# EAGLE schematic sx1509-breakout_mount_remap5 (EAGLE 9.1.3)
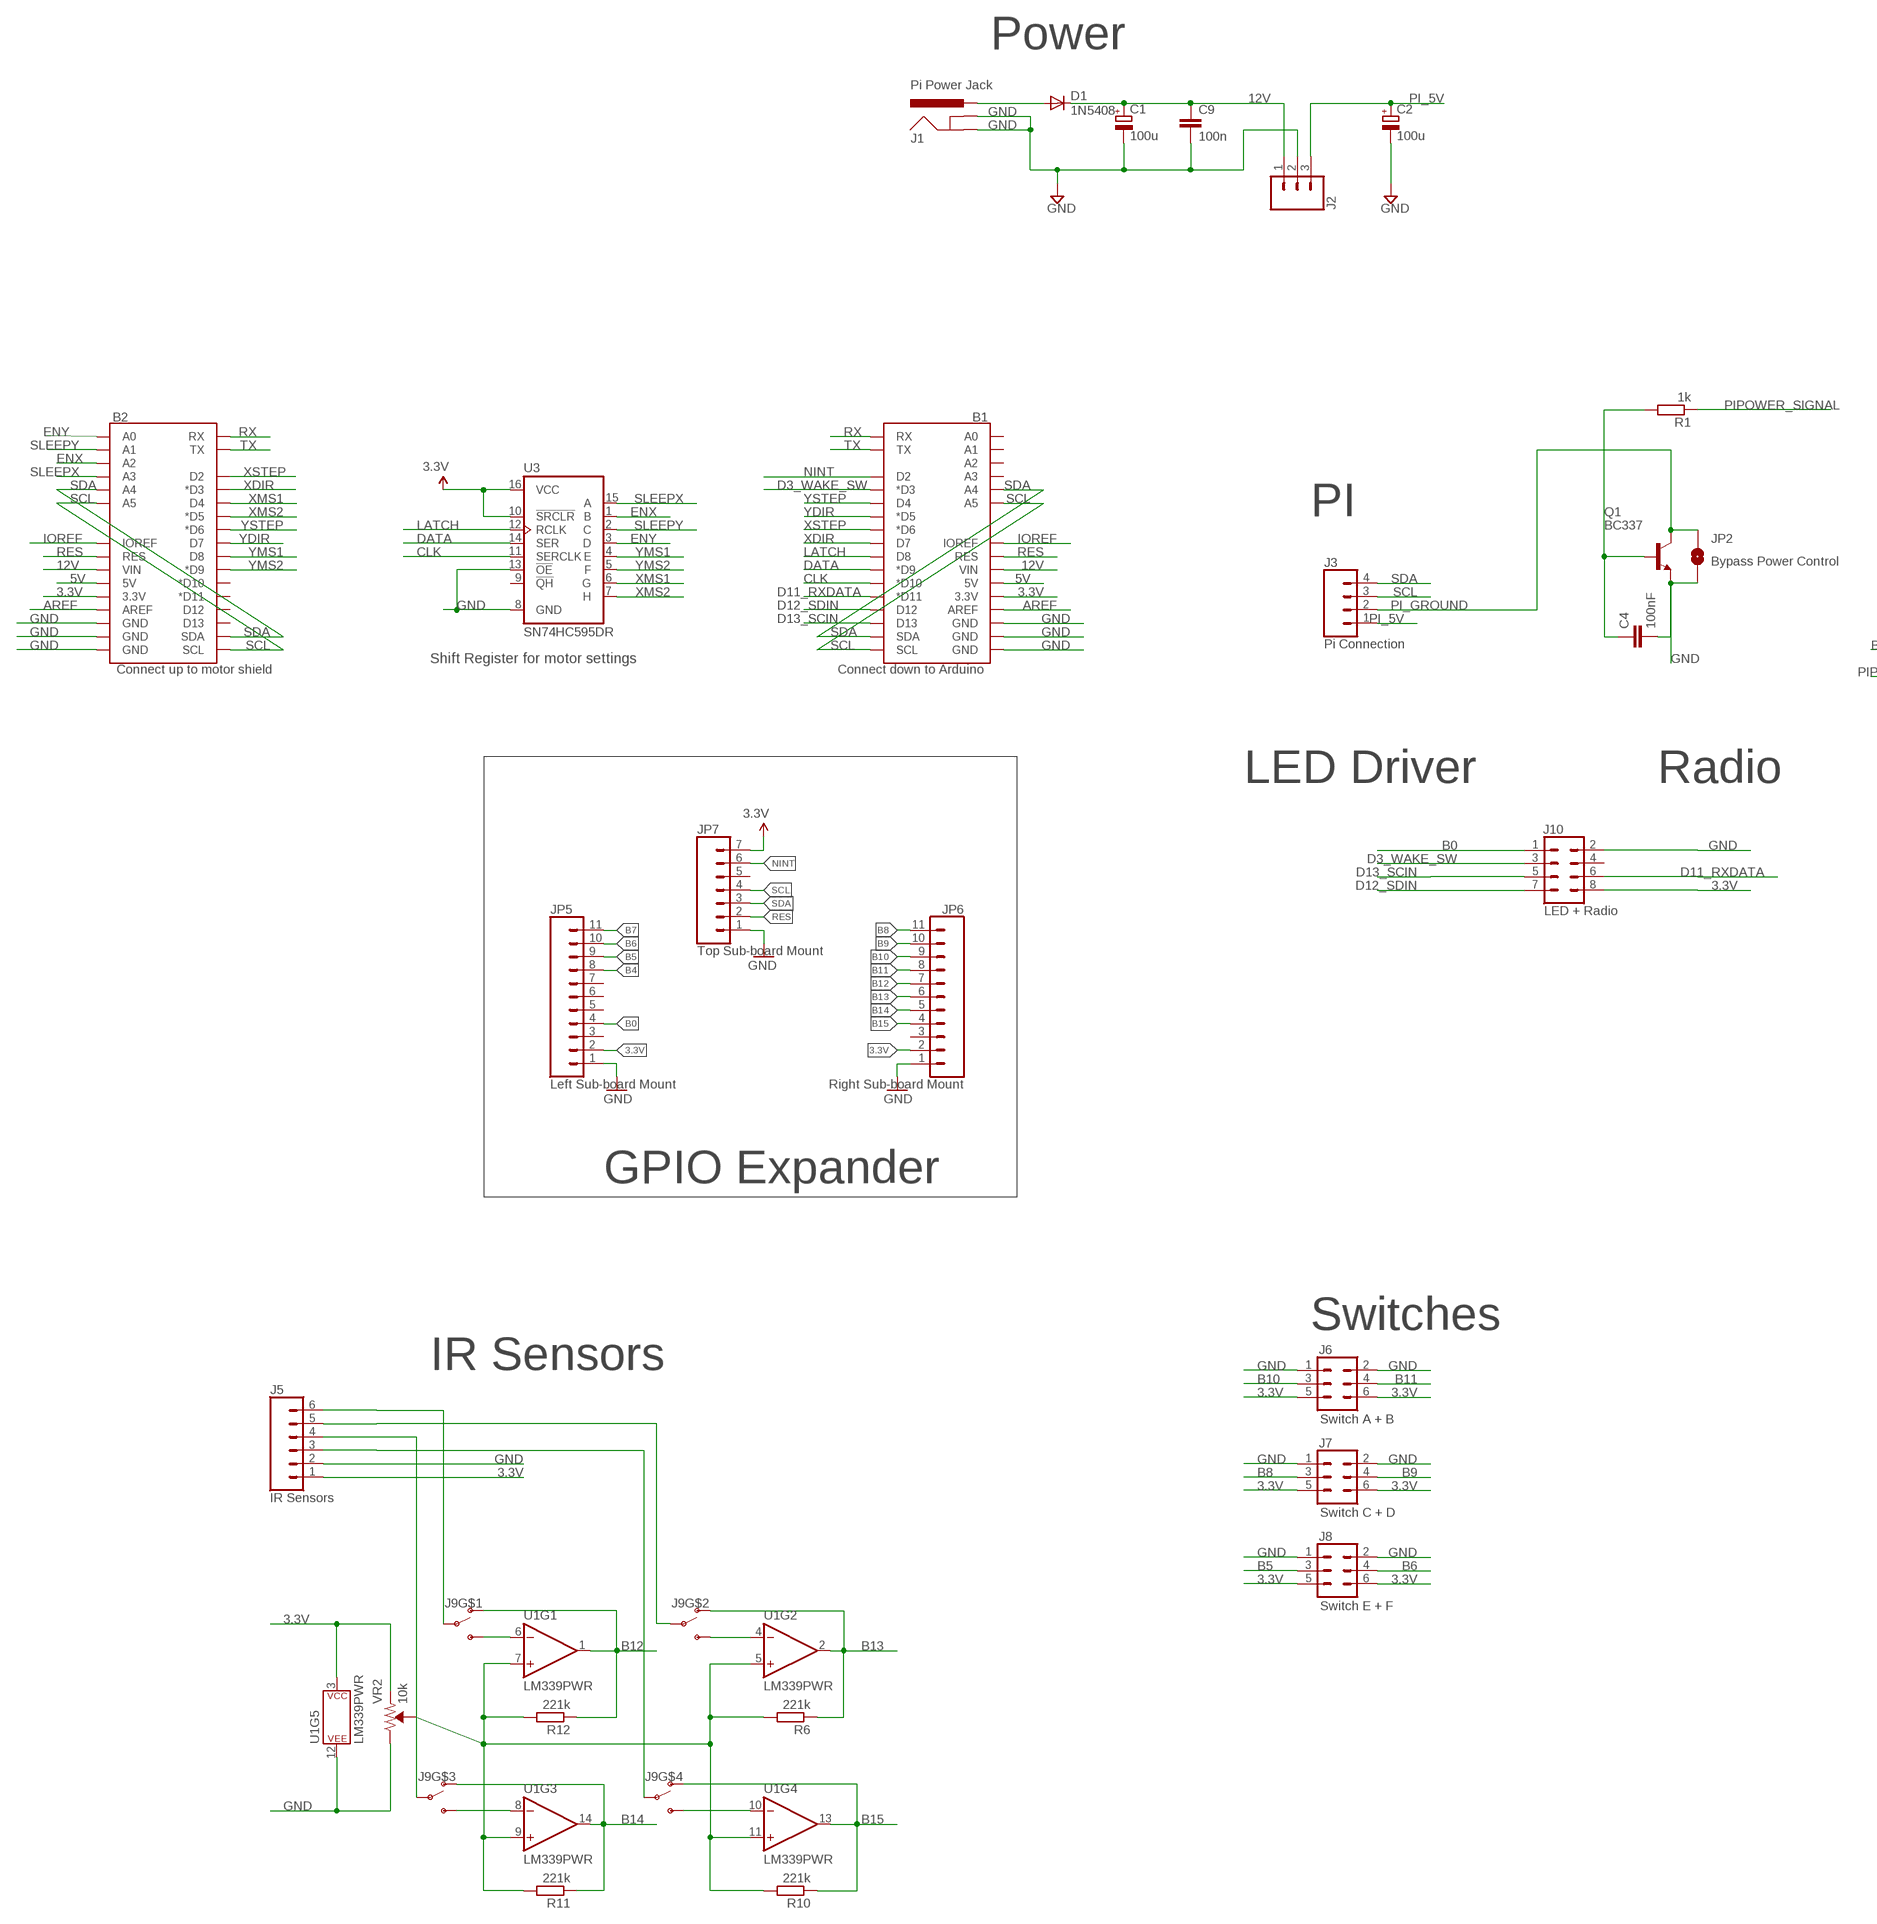
[diagram p0: schematic, sheet 1, part 1 of 2]
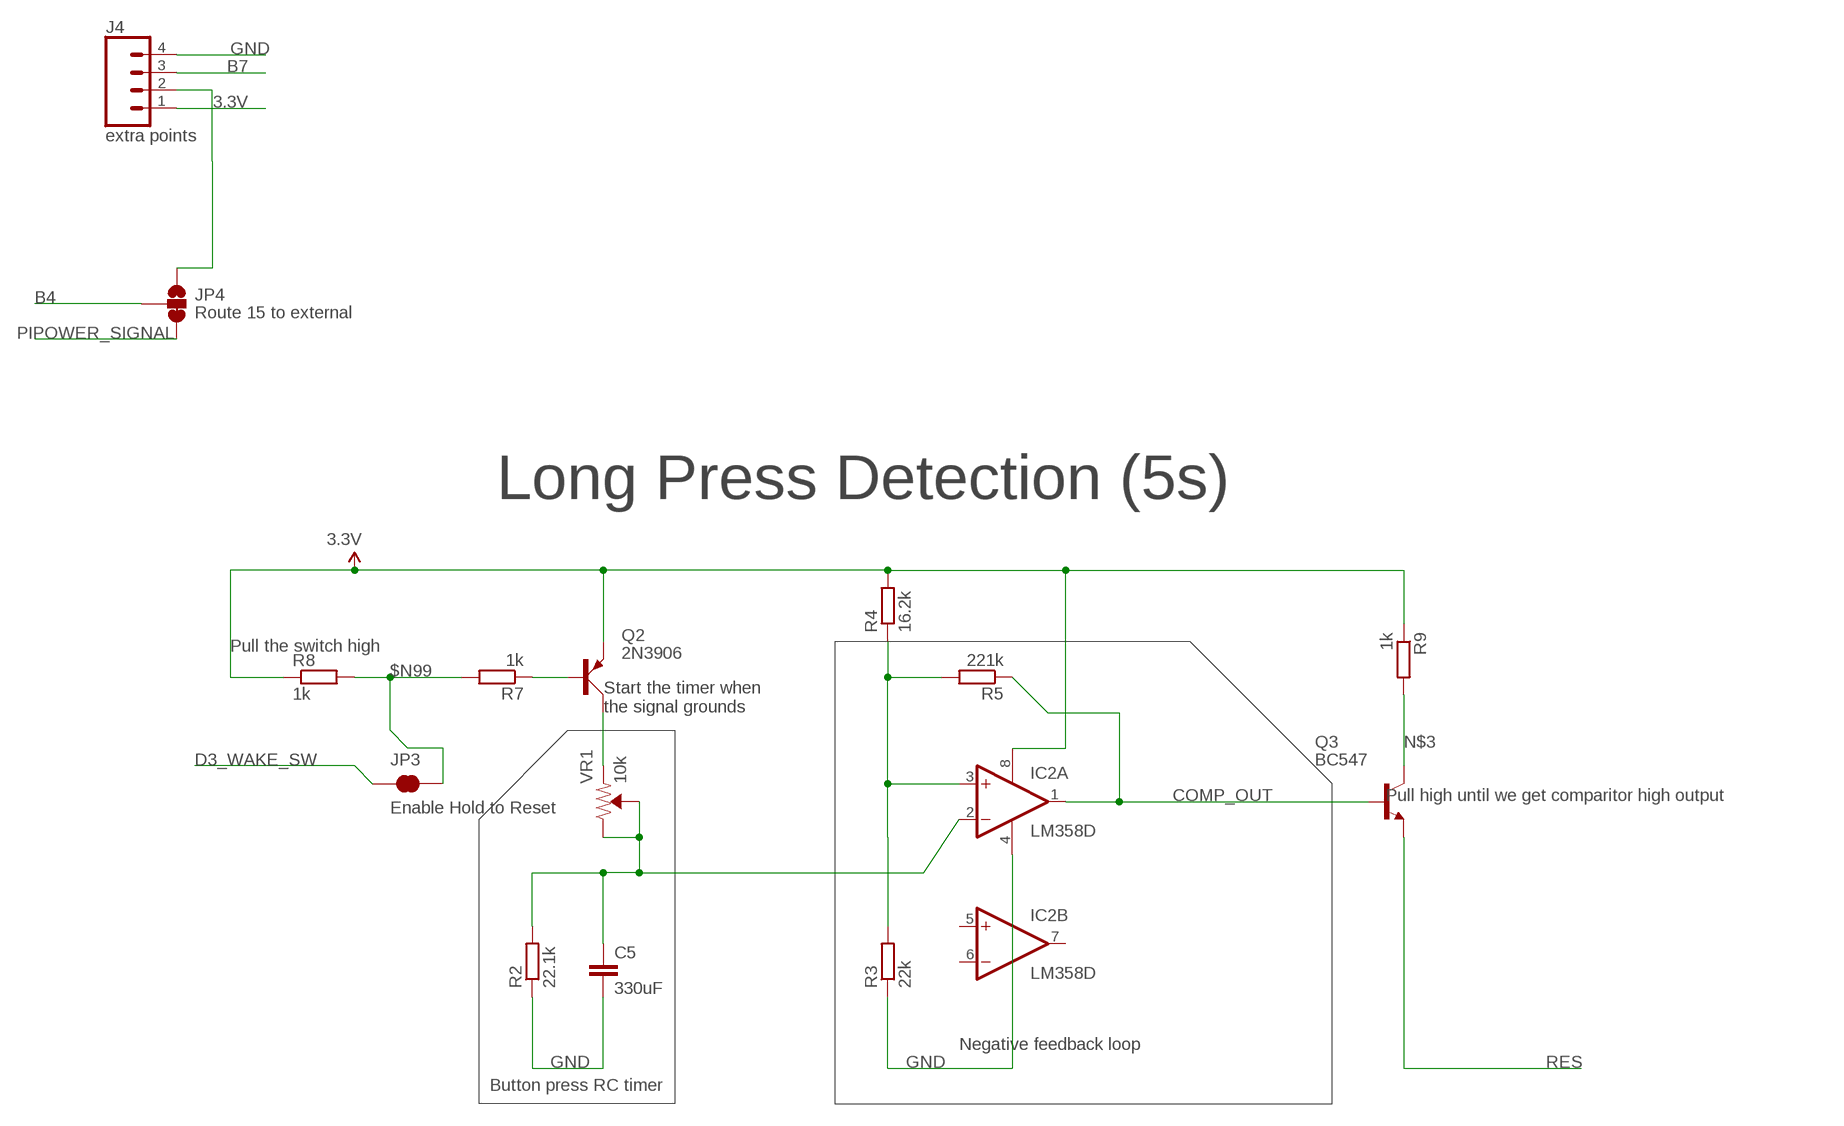
[diagram p1: schematic, sheet 1, part 2 of 2]

## Parts
B1  Connect down to Arduino  ARDUINO_UNO_R3_SHIELDNOLABELS  [UNO_R3_SHIELD_NOLABELS]
B2  Connect up to motor shield  ARDUINO_UNO_R3_SHIELDNOLABELS  [UNO_R3_SHIELD_NOLABELS]
C1  100u  CPOL-EUE2-5  [E2-5]
C2  100u  CPOL-EUE2-5  [E2-5]
C4  100nF  C-EUC0805  [C0805]
C5  330uF  C-EUC0805  [C0805]
C9  100n  C-EUC0805  [C0805]
D1  1N5408  [DO15-12]
IC2  LM358D  [SO08]
J1  Pi Power Jack  POWER_JACKPTH_BREAD  [POWER_JACK_PTH_BREAD]
J2  Header - Right angled, female  CONN_031X03_2.54MM_RA_FEMALE  [1X03]
J3  Pi Connection  CONN_041X04_1.24MM_RA_MALE  [1X04_1.24MM_RA_MALE]
J4  extra points  CONN_041X04_1.24MM_RA_MALE  [1X04_1.24MM_RA_MALE]
J5  IR Sensors  CONN_06SILK_FEMALE_PTH  [1X06]
J6  Switch A + B  CONN_03X22X03_2.54MM_RA_MALE  [2X3]
J7  Switch C + D  CONN_03X22X03_2.54MM_RA_MALE  [2X3]
J8  Switch E + F  CONN_03X22X03_2.54MM_RA_MALE  [2X3]
J9  CONN_04X3  [3X04_1.24MM_RA_MALE]
J10  LED + Radio  CONN_04X22X4_1.24MM_RA_MALE  [2X4]
JP2  Bypass Power Control  JUMPER-SMT_2_NO_SILK_ROUND  [SMT-JUMPER_2_NO_SILK_ROUND]
JP3  Enable Hold to Reset  JUMPER-SMT_2_NC_TRACE_SILK  [SMT-JUMPER_2_NC_TRACE_SILK]
JP4  Route 15 to external  JUMPER-SMT_3_1-NC_TRACE_SILK  [SMT-JUMPER_3_1-NC_TRACE_SILK]
JP5  Left Sub-board Mount  CONN_111X11_2.54MM_FEMALE  [1X11]
JP6  Right Sub-board Mount  CONN_111X11_2.54MM_FEMALE  [1X11]
JP7  Top Sub-board Mount  CONN_071X07_2.54MM_FEMALE  [1X07]
Q1  BC337  [TO92]
Q2  2N3906  [TO92D]
Q3  BC547  [TO92]
R1  1k  R-EU_M0805  [M0805]
R2  22.1k  R-EU_M0805  [M0805]
R3  22k  R-EU_M0805  [M0805]
R4  16.2k  R-EU_M0805  [M0805]
R5  221k  R-EU_M0805  [M0805]
R6  221k  R-EU_M0805  [M0805]
R7  1k  R-EU_M0805  [M0805]
R8  1k  R-EU_M0805  [M0805]
R9  1k  R-EU_M0805  [M0805]
R10  221k  R-EU_M0805  [M0805]
R11  221k  R-EU_M0805  [M0805]
R12  221k  R-EU_M0805  [M0805]
U1  LM339PWR  LM339  [TSSOP-14]
U3  SN74HC595DR  SN74HC595HCD  [SO16]
VR1  10k  TRIMPOT-PTH-10MM-KNOB-1/2W-10%  [TRIMPOT-PTH-3386U]
VR2  10k  TRIMPOT-PTH-10MM-KNOB-1/2W-10%  [TRIMPOT-PTH-3386U]

## Nets
3.3V: B1.3.3V B2.3.3V IC2.8(P:V+) J4.1 J5.1 J6.5 J6.6 J7.5 J7.6 J8.5 J8.6 J10.8 JP5.2 JP6.2 JP7.7 Q2.E R4.2 R8.1 R9.1 U1.3(P$V+) U3.10(!SRCLR) U3.16(VCC) VR2.1(CCW)
5V: B1.5V B2.5V
12V [12v]: B1.VIN B2.VIN C1.+ C9.1 D1.C J2.1
15_PLUG: J4.2 JP4.1
$N99: JP3.2 R7.2 R8.2
AREF: B1.AREF B2.AREF
B0: J10.1 JP5.4
B4: JP4.2 JP5.8
B5: J8.3 JP5.9
B6: J8.4 JP5.10
B7: J4.3 JP5.11
B8: J7.3 JP6.11
B9: J7.4 JP6.10
B10: J6.3 JP6.9
B11: J6.4 JP6.8
B12: J9.2(O) JP6.7 R12.1 U1.1(OUT)
B13: J9.5(O) JP6.6 R6.1 U1.2(OUT)
B14: J9.8(O) JP6.5 R11.1 U1.14(OUT)
B15: J9.11(O) JP6.4 R10.1 U1.13(OUT)
CLK: B1.D10(*D10) U3.11(SERCLK)
COMP_OUT: IC2.1(A:OUT) Q3.2(B) R5.1
D3_WAKE_SW: B1.D3(*D3) J10.3 JP3.1
D11_RXDATA: B1.D11(*D11) J10.6
D12_SDIN: B1.D12 J10.7
D13_SCIN: B1.D13 J10.5
DATA: B1.D9(*D9) U3.14(SER)
ENX: B2.A2 U3.1(B)
ENY: B2.A0 U3.3(D)
GND [5v]: B1.GND@0(GND) B1.GND@1(GND) B1.GND@2(GND) B2.GND@0(GND) B2.GND@1(GND) B2.GND@2(GND) C1.- C2.- C4.2 C5.2 C9.2 IC2.4(P:V-) J1.GND J1.GNDBREAK J2.2 J4.4 J5.2 J6.1 J6.2 J7.1 J7.2 J8.1 J8.2 J10.2 JP2.2 JP5.1 JP6.1 JP7.1 Q1.1(E) R2.1 R3.1 U1.12(P$V-) U3.8(GND) U3.13(!OE) VR2.3(CW)
IOREF: B1.IOREF B2.IOREF
LATCH: B1.D8 U3.12(RCLK)
N$1: Q2.B R7.1
N$2: C4.1 Q1.2(B) R1.2
N$3: Q3.3(C) R9.2
N$4 [12v]: D1.A J1.PWR
N$5: IC2.3(A:+IN) R3.2 R4.1 R5.2
N$7: Q2.C VR1.1(CCW)
N$8: C5.1 IC2.2(A:-IN) R2.2 VR1.2(WIPER) VR1.3(CW)
N$9: J5.6 J9.1(P)
N$10: J9.6(S) U1.4(-IN)
N$11: J5.4 J9.7(P)
N$12: J9.12(S) U1.10(-IN)
N$13: J9.9(S) U1.8(-IN)
N$14: J9.3(S) U1.6(-IN)
N$15: J5.5 J9.4(P)
N$16: J5.3 J9.10(P)
N$17: R6.2 R10.2 R11.2 R12.2 U1.5(+IN) U1.7(+IN) U1.9(+IN) U1.11(+IN) VR2.2(WIPER)
NINT: B1.D2 JP7.6
PI_5V [5v]: C2.+ J2.3 J3.1
PI_GROUND [5v]: J3.2 JP2.1 Q1.3(C)
PIPOWER_SIGNAL: JP4.3 R1.1
RES: B1.RES B2.RES JP7.2 Q3.1(E)
RX: B1.RX B2.RX
SCL: B1.A5 B1.SCL B2.A5 B2.SCL J3.3 JP7.4
SDA: B1.A4 B1.SDA B2.A4 B2.SDA J3.4 JP7.3
SLEEPX: B2.A3 U3.15(A)
SLEEPY: B2.A1 U3.2(C)
TX: B1.TX B2.TX
XDIR: B1.D7 B2.D3(*D3)
XMS1: B2.D4 U3.6(G)
XMS2: B2.D5(*D5) U3.7(H)
XSTEP: B1.D6(*D6) B2.D2
YDIR: B1.D5(*D5) B2.D7
YMS1: B2.D8 U3.4(E)
YMS2: B2.D9(*D9) U3.5(F)
YSTEP: B1.D4 B2.D6(*D6)
Unconnected: B1.A0 B1.A1 B1.A2 B1.A3 B2.D10(*D10) B2.D11(*D11) B2.D12 B2.D13 IC2.5(B:+IN) IC2.6(B:-IN) IC2.7(B:OUT) J10.4 JP5.3 JP5.5 JP5.6 JP5.7 JP6.3 JP7.5 U3.9(!QH)

## Notes on the sheet
- Power
- PI
- Shift Register for motor settings
- LED Driver | Radio | Long Press Detection (5s)
- Start the timer when
  the signal grounds
- GPIO Expander
- Negative feedback loop
- Button press RC timer
- Switches
- IR Sensors

## Library data of the parts
B1 B2 = keir_library:ARDUINO_UNO_R3_SHIELD: Arduino R3 Shield Footprint Shield form compatible with the Arduino Uno R3. SparkFun Products: MG2639 Cellular Shield <https://www.sparkfun.com/products/13120> MIDI Shield <https://www.sparkfun.com/products/12898> R3 Stackable Headers Kit <https://www.sparkfun.com/products/11417>
C1 C2 = rcl:CPOL-EU: POLARIZED CAPACITOR, European symbol; SPICEPREFIX: C
C4 C5 = resistor:C-EU: CAPACITOR, European symbol
C9 = rcl:C-EU: CAPACITOR, European symbol; SPICEPREFIX: C
D1 = keir_library:1N5408: DIODE controlled avalanche rectifier
IC2 = keir_library:LM358: OP AMP also LM158; LM258; LM2904 Source: http://cache.national.com/ds/LM/LM158.pdf
J1 = SparkFun-Connectors:POWER_JACK: Power Jack Connector This is the standard 5.5mm barrel jack for power. The PTH is the most common, proven, reliable, footprint. The Slot footprint only works if the mill layer is transmitted to the PCB fab house so be warned. Here are the connectors we sell at SparkFun: DC Barrel Power Jack/Connector <https://www.sparkfun.com/products/119> (PRT-00119) DC Barrel Power Jack/Connector (SMD) <https://www.sparkfun.com/products/12748> (PRT-12748) DC Barrel Jack Adapter - Breadboard Compatible <https://www.sparkfun.com/products/10811> (PRT-10811) It is used on this SparkFun product (and many, many others): SparkFun RedBoard - Programmed with Arduino <https://www.sparkfun.com/products/12757> (DEV-12757) Also, if you need a mating power supply or connector, please check these out: Wall Adapter Power Supply - 9VDC 650mA <https://www.sparkfun.com/products/298> (TOL-00298) DC Barrel Jack Adapter - Male <https://www.sparkfun.com/products/10287> (PRT-10287); PROD_ID: PRT-10811
J2 = keir_library:CONN_03: Multi connection point. Often used as Generic Header-pin footprint for 0.1 inch spaced/style header connections On any of the 0.1 inch spaced packages, you can populate with these: Break Away Headers - Straight <https://www.sparkfun.com/products/116> (PRT-00116) Break Away Male Headers - Right Angle <https://www.sparkfun.com/products/553> (PRT-00553) Female Headers <https://www.sparkfun.com/products/115> (PRT-00115) Break Away Headers - Machine Pin <https://www.sparkfun.com/products/117> (PRT-00117) Break Away Female Headers - Swiss Machine Pin <https://www.sparkfun.com/products/743> (PRT-00743) Stackable Header - 3 Pin (Female, 0.1") <https://www.sparkfun.com/products/13875> (PRT-13875) For SCREWTERMINALS and SPRING TERMINALS visit here: Screw Terimnals on SparkFun.com <https://www.sparkfun.com/search/results?term=Screw+Terminals> (5mm/3.5mm/2.54mm spacing) This device is also useful as a general connection point to wire up your design to another part of your project. Our various solder wires solder well into these plated through hole pads. Hook-Up Wire - Assortment (Stranded, 22 AWG) <https://www.sparkfun.com/products/11375> (PRT-11375) Hook-Up Wire - Assortment (Solid Core, 22 AWG) <https://www.sparkfun.com/products/11367> (PRT-11367) View the entire wire category on our website here <https://www.sparkfun.com/categories/141> Special notes: Molex polarized connector foot print use with SKU : PRT-08232 with associated crimp pins and housings.
J3 J4 = keir_library:CONN_04: Multi connection point. Often used as Generic Header-pin footprint for 0.1 inch spaced/style header connections On any of the 0.1 inch spaced packages, you can populate with these: Break Away Headers - Straight <https://www.sparkfun.com/products/116> (PRT-00116) Break Away Male Headers - Right Angle <https://www.sparkfun.com/products/553> (PRT-00553) Female Headers <https://www.sparkfun.com/products/115> (PRT-00115) Break Away Headers - Machine Pin <https://www.sparkfun.com/products/117> (PRT-00117) Break Away Female Headers - Swiss Machine Pin <https://www.sparkfun.com/products/743> (PRT-00743) For SCREWTERMINALS and SPRING TERMINALS visit here: Screw Terimnals on SparkFun.com <https://www.sparkfun.com/search/results?term=Screw+Terminals> (5mm/3.5mm/2.54mm spacing) This device is also useful as a general connection point to wire up your design to another part of your project. Our various solder wires solder well into these plated through hole pads. Hook-Up Wire - Assortment (Stranded, 22 AWG) <https://www.sparkfun.com/products/11375> (PRT-11375) Hook-Up Wire - Assortment (Solid Core, 22 AWG) <https://www.sparkfun.com/products/11367> (PRT-11367) View the entire wire category on our website here <https://www.sparkfun.com/categories/141> Special notes: Molex polarized connector foot print use with SKU : PRT-08231 with associated crimp pins and housings. 1MM SMD Version SKU: PRT-10208
J5 = SparkFun-Connectors:CONN_06: Multi connection point. Often used as Generic Header-pin footprint for 0.1 inch spaced/style header connections On any of the 0.1 inch spaced packages, you can populate with these: Break Away Headers - Straight <https://www.sparkfun.com/products/116> (PRT-00116) Break Away Male Headers - Right Angle <https://www.sparkfun.com/products/553> (PRT-00553) Female Headers <https://www.sparkfun.com/products/115> (PRT-00115) Break Away Headers - Machine Pin <https://www.sparkfun.com/products/117> (PRT-00117) Break Away Female Headers - Swiss Machine Pin <https://www.sparkfun.com/products/743> (PRT-00743) Arduino Stackable Header - 6 Pin <https://www.sparkfun.com/products/9280> (PRT-09280) For SCREWTERMINALS and SPRING TERMINALS visit here: Screw Terimnals on SparkFun.com <https://www.sparkfun.com/search/results?term=Screw+Terminals> (5mm/3.5mm/2.54mm spacing) This device is also useful as a general connection point to wire up your design to another part of your project. Our various solder wires solder well into these plated through hole pads. Hook-Up Wire - Assortment (Stranded, 22 AWG) <https://www.sparkfun.com/products/11375> (PRT-11375) Hook-Up Wire - Assortment (Solid Core, 22 AWG) <https://www.sparkfun.com/products/11367> (PRT-11367) View the entire wire category on our website here <https://www.sparkfun.com/categories/141>; PROD_ID: CONN-08437
J6-J8 = keir_library:CONN_03X2: Multi connection point. Often used as Generic Header-pin footprint for 0.1 inch spaced/style header connections You can populate with any combo of single row headers, but if you'd like an exact match, check these: Header - 2x3 (Male, 0.1") <https://www.sparkfun.com/products/12807> (PRT-12807) Header - 2x3 (Female, 0.1") <https://www.sparkfun.com/products/13010> (PRT-13010) 2x3 Pin Shrouded Header <https://www.sparkfun.com/products/10877> (PRT-10877) On any of the 0.1 inch spaced packages, you can populate with these: Break Away Headers - Straight <https://www.sparkfun.com/products/116> (PRT-00116) Break Away Male Headers - Right Angle <https://www.sparkfun.com/products/553> (PRT-00553) Female Headers <https://www.sparkfun.com/products/115> (PRT-00115) Break Away Headers - Machine Pin <https://www.sparkfun.com/products/117> (PRT-00117) Break Away Female Headers - Swiss Machine Pin <https://www.sparkfun.com/products/743> (PRT-00743) Special note: the shrouded connector mates well with our 3x2 ribbon cables: Ribbon Crimp Connector - 6-pin (2x3, Female) <https://www.sparkfun.com/products/10651> (PRT-10651) Ribbon Cable - 6 wire (15ft) <https://www.sparkfun.com/products/10646> (PRT-10646)
J9 = keir_library:CONN_04X3: Multi connection point. Often used as Generic Header-pin footprint for 0.1 inch spaced/style header connections On any of the 0.1 inch spaced packages, you can populate with these: Break Away Headers - Straight <https://www.sparkfun.com/products/116> (PRT-00116) Break Away Male Headers - Right Angle <https://www.sparkfun.com/products/553> (PRT-00553) Female Headers <https://www.sparkfun.com/products/115> (PRT-00115) Break Away Headers - Machine Pin <https://www.sparkfun.com/products/117> (PRT-00117) Break Away Female Headers - Swiss Machine Pin <https://www.sparkfun.com/products/743> (PRT-00743) For SCREWTERMINALS and SPRING TERMINALS visit here: Screw Terimnals on SparkFun.com <https://www.sparkfun.com/search/results?term=Screw+Terminals> (5mm/3.5mm/2.54mm spacing) This device is also useful as a general connection point to wire up your design to another part of your project. Our various solder wires solder well into these plated through hole pads. Hook-Up Wire - Assortment (Stranded, 22 AWG) <https://www.sparkfun.com/products/11375> (PRT-11375) Hook-Up Wire - Assortment (Solid Core, 22 AWG) <https://www.sparkfun.com/products/11367> (PRT-11367) View the entire wire category on our website here <https://www.sparkfun.com/categories/141> Special notes: Molex polarized connector foot print use with SKU : PRT-08231 with associated crimp pins and housings. 1MM SMD Version SKU: PRT-10208
J10 = keir_library:CONN_04X2: Multi connection point. Often used as Generic Header-pin footprint for 0.1 inch spaced/style header connections On any of the 0.1 inch spaced packages, you can populate with these: Break Away Headers - Straight <https://www.sparkfun.com/products/116> (PRT-00116) Break Away Male Headers - Right Angle <https://www.sparkfun.com/products/553> (PRT-00553) Female Headers <https://www.sparkfun.com/products/115> (PRT-00115) Break Away Headers - Machine Pin <https://www.sparkfun.com/products/117> (PRT-00117) Break Away Female Headers - Swiss Machine Pin <https://www.sparkfun.com/products/743> (PRT-00743)
JP2 = SparkFun-Jumpers:JUMPER-SMT_2_NO: Normally open jumper This jumper has two pads in close proximity to each other. Apply solder to close the connection. Round pads are easier to solder for beginners, but are a lot larger. SparkFun Product that uses the round pads: SparkFun EL Sequencer <https://www.sparkfun.com/products/12781>
JP3 = SparkFun-Jumpers:JUMPER-SMT_2_NC_TRACE: Normally closed trace jumper This jumper has a trace between two pads so it's normally closed (NC). Use a razor knife to open the connection. For best results follow the IPC guidelines for cutting traces: Cutout at least 0.063 mm (0.005 in). Remove all loose material to clean up the cut area. Seal the cut with an approved epoxy. Reapply solder to reclose the connection.
JP4 = SparkFun-Jumpers:JUMPER-SMT_3_1-NC_TRACE: Normally closed trace jumper (1 of 2 connections) This jumper has a trace between two pads so it's normally closed (NC). The other connection is normally open (NO). Use a razor knife to open the connection. For best results follow the IPC guidelines for cutting traces: Cutout at least 0.063 mm (0.005 in). Remove all loose material to clean up the cut area. Seal the cut with an approved epoxy. Reapply solder to reclose the connection, or to close the NO connection.
JP5 JP6 = keir_library:CONN_11: Multi connection point. Often used as Generic Header-pin footprint for 0.1 inch spaced/style header connections On any of the 0.1 inch spaced packages, you can populate with these: Break Away Headers - Straight <https://www.sparkfun.com/products/116> (PRT-00116) Break Away Male Headers - Right Angle <https://www.sparkfun.com/products/553> (PRT-00553) Female Headers <https://www.sparkfun.com/products/115> (PRT-00115) Break Away Headers - Machine Pin <https://www.sparkfun.com/products/117> (PRT-00117) Break Away Female Headers - Swiss Machine Pin <https://www.sparkfun.com/products/743> (PRT-00743) For SCREWTERMINALS and SPRING TERMINALS visit here: Screw Terimnals on SparkFun.com <https://www.sparkfun.com/search/results?term=Screw+Terminals> (5mm/3.5mm/2.54mm spacing) This device is also useful as a general connection point to wire up your design to another part of your project. Our various solder wires solder well into these plated through hole pads. Hook-Up Wire - Assortment (Stranded, 22 AWG) <https://www.sparkfun.com/products/11375> (PRT-11375) Hook-Up Wire - Assortment (Solid Core, 22 AWG) <https://www.sparkfun.com/products/11367> (PRT-11367) View the entire wire category on our website here <https://www.sparkfun.com/categories/141>
JP7 = keir_library:CONN_07: Multi connection point. Often used as Generic Header-pin footprint for 0.1 inch spaced/style header connections On any of the 0.1 inch spaced packages, you can populate with these: Break Away Headers - Straight <https://www.sparkfun.com/products/116> (PRT-00116) Break Away Male Headers - Right Angle <https://www.sparkfun.com/products/553> (PRT-00553) Female Headers <https://www.sparkfun.com/products/115> (PRT-00115) Break Away Headers - Machine Pin <https://www.sparkfun.com/products/117> (PRT-00117) Break Away Female Headers - Swiss Machine Pin <https://www.sparkfun.com/products/743> (PRT-00743) For SCREWTERMINALS and SPRING TERMINALS visit here: Screw Terimnals on SparkFun.com <https://www.sparkfun.com/search/results?term=Screw+Terminals> (5mm/3.5mm/2.54mm spacing) This device is also useful as a general connection point to wire up your design to another part of your project. Our various solder wires solder well into these plated through hole pads. Hook-Up Wire - Assortment (Stranded, 22 AWG) <https://www.sparkfun.com/products/11375> (PRT-11375) Hook-Up Wire - Assortment (Solid Core, 22 AWG) <https://www.sparkfun.com/products/11367> (PRT-11367) View the entire wire category on our website here <https://www.sparkfun.com/categories/141> Special notes: Molex polarized connector foot print use with SKU : PRT-08231 with associated crimp pins and housings. 1MM SMD Version SKU: PRT-10208 NOTES ON THE VARIANTS LOCK and LOCK_LONGPADS... This footprint was designed to help hold the alignment of a through-hole component (i.e. 6-pin header) while soldering it into place. You may notice that each hole has been shifted either up or down by 0.005 of an inch from it's more standard position (which is a perfectly straight line). This slight alteration caused the pins (the squares in the middle) to touch the edges of the holes. Because they are alternating, it causes a "brace" to hold the component in place. 0.005 has proven to be the perfect amount of "off-center" position when using our standard breakaway headers. Although looks a little odd when you look at the bare footprint, once you have a header in there, the alteration is very hard to notice. Also,if you push a header all the way into place, it is covered up entirely on the bottom side.
Q1 = transistor-npn:BC337*: NPN Transistor
Q2 = transistor-small-signal:2N3906: PNP TRANSISTOR
Q3 = transistor-npn:BC547*: NPN Transistor; NOTE: Pull high until we get comparitor high output
R1-R7 R9-R12 = rcl:R-EU_: RESISTOR, European symbol; SPICEPREFIX: R
R8 = rcl:R-EU_: RESISTOR, European symbol; NOTE: Pull the switch high; SPICEPREFIX: R
U1 = SparkFun-IC-Amplifiers:LM339: Quad Comparator - LM339PWR Based on information from the SLCS006N datasheet from TI (www.ti.com). Created by nick@scantool.net, 2008. Updated 2016. SparkFun Products SparkFun OBD-II UART <https://www.sparkfun.com/products/9555> (WIG-09555) SparkFun Car Diagnostics Kit <https://www.sparkfun.com/products/10769> (RTL-10769); PROD_ID: IC-09990
U3 = keir_library:SN74HC595: 8-Bit Shift Register (Serial to Parallel) Datasheet <http://www.ti.com/lit/ds/symlink/sn74hc595.pdf> SparkFun Products Shift-In parallel out - SN74HC595; PROD_ID: IC-11325; VALUE: SN74HC165DR
VR1 VR2 = SparkFun-Resistors:TRIMPOT: Trimming Potentiometer (Trimpot) Three-terminal potentiometers, with an adjustable wiper and two adjustable resistors. A pot can be used to create a configurable voltage divider, or as a variable resistor. "Trimpots" are a subset of potentiometers, usually intended for "set-and-forget" applications. They're often more delicate than standard potentiometers - rated for fewer turns. Variants PTH-KNOB - PTH Trimpot w/ finger-adjustable knob Trimpot 10K with Knob <https://www.sparkfun.com/products/9806> (COM-09806) Datasheet <http://www.sparkfun.com/datasheets/Components/General/TSR-3386.pdf> SMD-3MM-CLOSED-FRAME - SMD 3mm Square Closed-Frame Trimpot Used on e.g. EasyDriver - Stepper Motor Driver <https://www.sparkfun.com/products/12779> Datasheet <http://www.bitechnologies.com/pdfs/22.pdf> (22AR10KTR) SMD-5MM - SMD 5mm Square Closed-Frame Trimpot Used on e.g. IOIO-OTG - V2.2 <https://www.sparkfun.com/products/13613> Datasheet <http://www.vishay.com/docs/51008/ts53.pdf> (TS53YL502MR10) SMD-3MM-1/10W-25% - 3mm Square Open-Frame Trimpot Used on e.g. SparkFun Shapeoko <https://www.sparkfun.com/products/13899> Datasheet <http://www.bourns.com/docs/Product-Datasheets/TC33.pdf> (TC33X-2-103E); PROD_ID: RES-09730; SF_SKU: COM-09806

## Net classes
1 12v: width 1.6 mm, clearance 0.31 mm
2 5v: width 1.6 mm